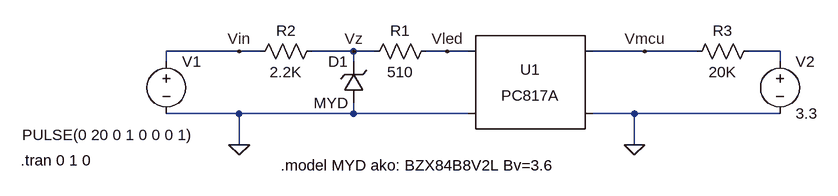
[diagram p0: schematic Key_Input_LTspice_Model.asc]
Key_Input_LTspice_Model.asc, the LTspice schematic file:
Version 4
SHEET 1 880 680
WIRE -368 128 -480 128
WIRE -336 128 -368 128
WIRE -192 128 -256 128
WIRE -160 128 -192 128
WIRE -48 128 -80 128
WIRE -16 128 -48 128
WIRE 256 128 176 128
WIRE 336 128 256 128
WIRE 464 128 416 128
WIRE -480 144 -480 128
WIRE -192 144 -192 128
WIRE 464 144 464 128
WIRE -368 224 -480 224
WIRE -192 224 -192 208
WIRE -192 224 -368 224
WIRE -16 224 -192 224
WIRE 240 224 176 224
WIRE 464 224 240 224
WIRE -368 272 -368 224
WIRE 240 272 240 224
FLAG 240 272 0
FLAG -368 272 0
FLAG 256 128 Vmcu
FLAG -368 128 Vin
FLAG -192 128 Vz
FLAG -48 128 Vled
SYMBOL res -64 112 R90
WINDOW 0 0 56 VBottom 2
WINDOW 3 32 56 VTop 2
SYMATTR InstName R1
SYMATTR Value 510
SYMBOL res -240 112 R90
WINDOW 0 0 56 VBottom 2
WINDOW 3 32 56 VTop 2
SYMATTR InstName R2
SYMATTR Value 2.2K
SYMBOL res 432 112 R90
WINDOW 0 0 56 VBottom 2
WINDOW 3 32 56 VTop 2
SYMATTR InstName R3
SYMATTR Value 20K
SYMBOL voltage -480 128 R0
WINDOW 3 -222 129 Left 2
WINDOW 123 0 0 Left 0
WINDOW 39 0 0 Left 0
SYMATTR InstName V1
SYMATTR Value PULSE(0 20 0 1 0 0 0 1)
SYMBOL voltage 464 128 R0
WINDOW 123 0 0 Left 0
WINDOW 39 0 0 Left 0
SYMATTR InstName V2
SYMATTR Value 3.3
SYMBOL Optos\\PC817A 80 176 R0
SYMATTR InstName U1
SYMBOL zener -176 208 R180
WINDOW 0 24 64 Left 2
WINDOW 3 24 0 Left 2
SYMATTR InstName D1
SYMATTR Value MYD
TEXT -704 296 Left 2 !.tran 0 1 0
TEXT -304 304 Left 2 !.model MYD ako: BZX84B8V2L Bv=3.6

The netlist it stands for:
* Key_Input_LTspice_Model.asc
R1 Vled Vz 510
R2 Vz Vin 2.2K
R3 N001 Vmcu 20K
V1 Vin 0 PULSE(0 20 0 1 0 0 0 1)
V2 N001 0 3.3
XU1 Vled 0 Vmcu 0 PC817 Igain=1m
D1 0 Vz MYD
.model D D
.lib standard.dio
.tran 0 1 0
.model MYD ako: BZX84B8V2L Bv=3.6
.lib PC817.sub
.backanno
.end